# EAGLE design xv11_lidar_controller (EAGLE 6.2)
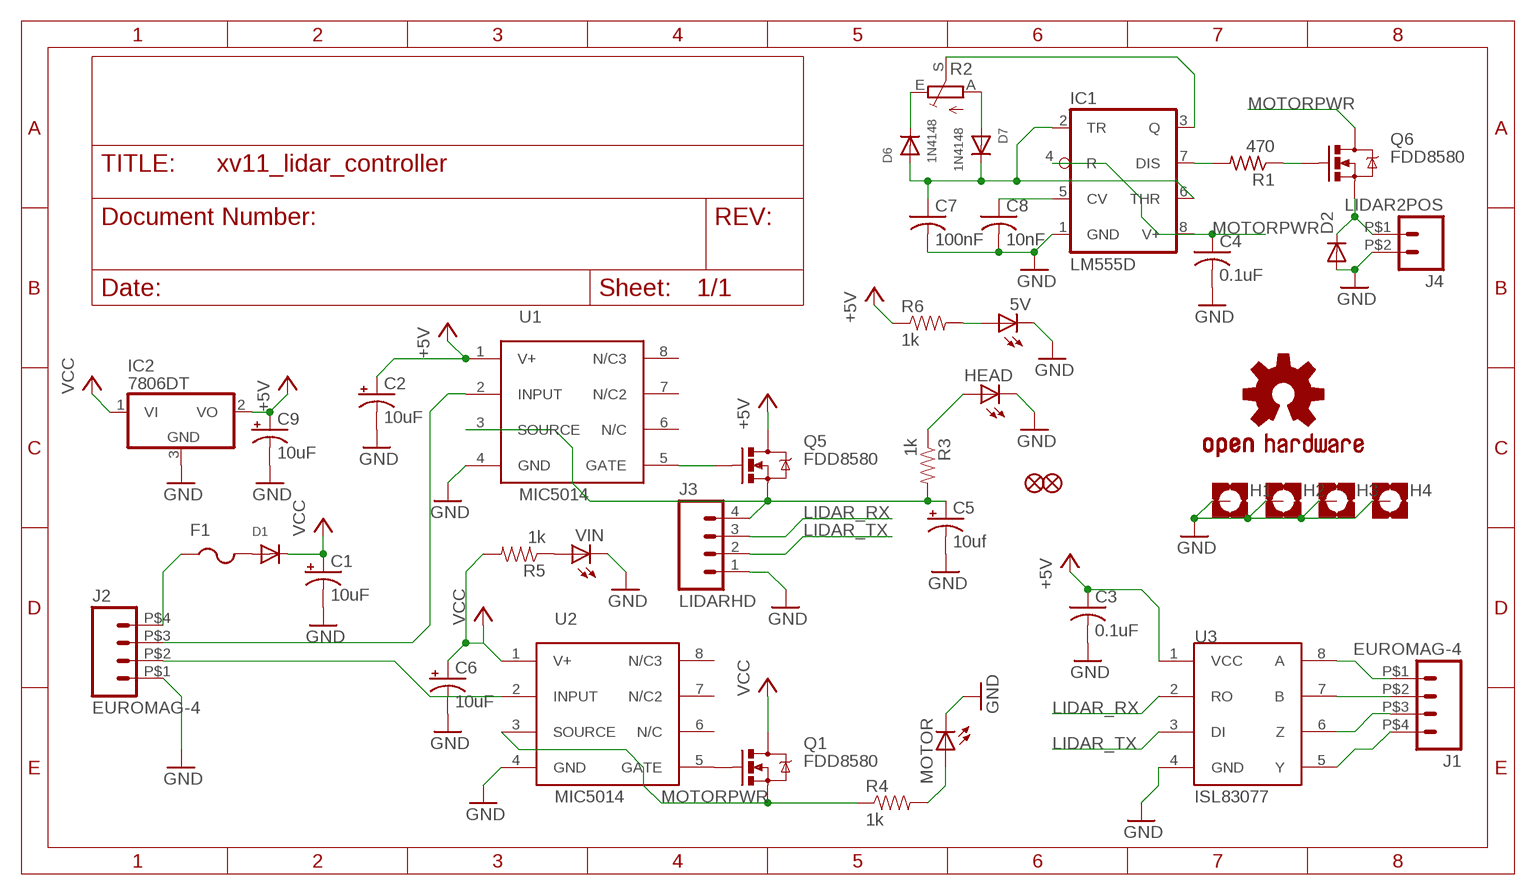
[diagram p0: schematic, sheet 1]

## Parts
5V  LEDCHIP-LED0805  [CHIP-LED0805]
C1  10uF  CPOL-USCT6032  [CT6032]
C2  10uF  CPOL-USCT6032  [CT6032]
C3  0.1uF  C-USC0805  [C0805]
C4  0.1uF  C-USC0805  [C0805]
C5  10uf  CPOL-USCT6032  [CT6032]
C6  10uF  CPOL-USCT6032  [CT6032]
C7  100nF  C-USC0805  [C0805]
C8  10nF  C-USC0805  [C0805]
C9  10uF  CPOL-USCT6032  [CT6032]
D1  DIODESMA  [SMADIODE]
D2  DIODESMA  [SMA-DIODE]
D6  1N4148  DIODESOD-323F  [SOD-323F]
D7  1N4148  DIODESOD-323F  [SOD-323F]
F1  PTCFUSE-1812  [1812]
H1  MOUNT-PAD-SQUARE5.5  [5,5-PAD-SQUARE]
H2  MOUNT-PAD-SQUARE5.5  [5,5-PAD-SQUARE]
H3  MOUNT-PAD-SQUARE5.5  [5,5-PAD-SQUARE]
H4  MOUNT-PAD-SQUARE5.5  [5,5-PAD-SQUARE]
HEAD  LEDCHIP-LED0805  [CHIP-LED0805]
IC1  LM555D  [SO08]
IC2  7806DT  [TO252]
J1  EUROMAG-4  [M4]
J2  EUROMAG-4  [M4]
J3  LIDARHD  LIDAR4POS  [2MM4POS]
J4  LIDAR2POS  [2MM2POS]
JP1  FIDUCIAL1.5X3  [FIDUCIAL-1.5X3]
JP2  FIDUCIAL1.5X3  [FIDUCIAL-1.5X3]
MOTOR  LEDCHIP-LED0805  [CHIP-LED0805]
Q1  FDD8580  MOSFET-NCHANNELFDD8580  [DPAK]
Q5  FDD8580  MOSFET-NCHANNELFDD8580  [DPAK]
Q6  FDD8580  MOSFET-NCHANNELFDD8580  [DPAK]
R1  470  R-US_R0805  [R0805]
R2  TRIM_EU-B25P  [B25P]
R3  1k  RESISTOR0805-RES  [0805]
R4  1k  RESISTOR0805-RES  [0805]
R5  1k  RESISTOR0805-RES  [0805]
R6  1k  RESISTOR0805-RES  [0805]
U1  MIC5014  [SO08]
U2  MIC5014  [SO08]
U3  ISL83077  [SO08]
U$2  OSHW-LOGOL  [OSHW-LOGO-L]
VIN  LEDCHIP-LED0805  [CHIP-LED0805]

## Nets
+5V: C2.+ C3.1 C9.+ IC2.2(VO) Q5.4(D) R6.1 U1.1(V+) U3.1(VCC)
GND: 5V.C C1.- C2.- C3.2 C4.2 C5.- C6.- C7.2 C8.2 C9.- D2.A H1.B5,5(MOUNT) H2.B5,5(MOUNT) H3.B5,5(MOUNT) H4.B5,5(MOUNT) HEAD.C IC1.1(GND) IC2.3(GND) J2.P$1 J3.1 J4.P$2 MOTOR.C U1.4(GND) U2.4(GND) U3.4(GND) VIN.C
LIDAR_RX: J3.3 U3.2(RO)
LIDAR_TX: J3.2 U3.3(DI)
MOTORPWR: C4.1 IC1.4(R) IC1.8(V+) Q1.3(S) Q6.4(D) R4.1 U2.3(SOURCE)
N$1: C5.+ J3.4 Q5.3(S) R3.2 U1.3(SOURCE)
N$2: J2.P$3 U1.2(INPUT)
N$3: HEAD.A R3.1
N$4: R5.1 VIN.A
N$5: Q5.1(G) U1.5(GATE)
N$6: MOTOR.A R4.2
N$7: 5V.A R6.2
N$8: J2.P$2 U2.2(INPUT)
N$9: J1.P$1 U3.8(A)
N$10: D1.A F1.2
N$11: F1.1 J2.P$4
N$12: C8.1 IC1.5(CV)
N$13: C7.1 D6.A D7.C IC1.2(TR) IC1.6(THR)
N$14: D6.C R2.E
N$15: J1.P$2 U3.7(B)
N$16: J1.P$3 U3.6(Z)
N$17: J1.P$4 U3.5(Y)
N$31: D7.A R2.A
N$32: IC1.3(Q) R2.S
N$33: IC1.7(DIS) R1.2
N$34: Q6.1(G) R1.1
N$35: D2.C J4.P$1 Q6.3(S)
N$40: Q1.1(G) U2.5(GATE)
VCC: C1.+ C6.+ D1.C IC2.1(VI) Q1.4(D) R5.2 U2.1(V+)
Unconnected: U1.6(N/C) U1.7(N/C2) U1.8(N/C3) U2.6(N/C) U2.7(N/C2) U2.8(N/C3)

## Library data of the parts
5V HEAD MOTOR VIN = adafruit:LED: LED OSRAM: - CHIPLED LG R971, LG N971, LY N971, LG Q971, LY Q971, LO R971, LY R971 LH N974, LH R974 LS Q976, LO Q976, LY Q976 LO Q996 - Hyper CHIPLED LW Q18S LB Q993, LB Q99A, LB R99A - SideLED LS A670, LO A670, LY A670, LG A670, LP A670 LB A673, LV A673, LT A673, LW A673 LH A674 LY A675 LS A676, LA A676, LO A676, LY A676, LW A676 LS A679, LY A679, LG A679 - Hyper Micro SIDELED® LS Y876, LA Y876, LO Y876, LY Y876 LT Y87S - SmartLED LW L88C, LW L88S LB L89C, LB L89S, LG L890 LS L89K, LO L89K, LY L89K LS L896, LA L896, LO L896, LY L896 - TOPLED LS T670, LO T670, LY T670, LG T670, LP T670 LSG T670, LSP T670, LSY T670, LOP T670, LYG T670 LG T671, LOG T671, LSG T671 LB T673, LV T673, LT T673, LW T673 LH T674 LS T676, LA T676, LO T676, LY T676, LB T676, LH T676, LSB T676, LW T676 LB T67C, LV T67C, LT T67C, LS T67K, LO T67K, LY T67K, LW E67C LS E67B, LA E67B, LO E67B, LY E67B, LB E67C, LV E67C, LT E67C LW T67C LS T679, LY T679, LG T679 LS T770, LO T770, LY T770, LG T770, LP T770 LB T773, LV T773, LT T773, LW T773 LH T774 LS E675, LA E675, LY E675, LS T675 LS T776, LA T776, LO T776, LY T776, LB T776 LHGB T686 LT T68C, LB T68C - Hyper Mini TOPLED® LB M676 - Mini TOPLED Santana® LG M470 LS M47K, LO M47K, LY M47K Source: http://www.osram.convergy.de/
C1 C2 C5 C6 C9 = adafruit:CPOL-US: POLARIZED CAPACITOR, American symbol
C3 C4 C7 C8 = adafruit:C-US: CAPACITOR, American symbol
D1 D6 D7 = adafruit:DIODE: Diode
D2 = SparkFun:DIODE: Diode
F1 = adafruit:PTCFUSE: PTC fuses, resettable thermistors
H1-H4 = holes:MOUNT-PAD-SQUARE: MOUNTING PAD, square
IC1 = adafruit:*555: TIMER Changed DIP package to have round (not oval) pin pads http://www.ladyada.net/library/pcb/eaglelibrary.html
IC2 = adafruit:78*: Positive VOLTAGE REGULATOR Added bigger pads to the TO-92 package
J1 J2 = NASA_LIB:EUROMAG-4
J3 = NASA_LIB:LIDAR4POS
J4 = NASA_LIB:LIDAR2POS
JP1 JP2 = SparkFun:FIDUCIAL: Fiducial Alignment Points Various fiducial points for machine vision alignment.
Q1 Q5 Q6 = SparkFun:MOSFET-NCHANNEL
R1 = adafruit:R-US_: RESISTOR, American symbol
R2 = pot:TRIM_EU-: POTENTIOMETER
R3-R6 = SparkFun:RESISTOR: Resistor Basic schematic elements and footprints for 0603, 1206, and PTH resistors.
U1 U2 = NASA_LIB:MIC5014
U3 = NASA_LIB:ISL83077
U$2 = SparkFun:OSHW-LOGO: Open Source Hardware Logo This logo indicates the piece of hardware it is found on incorporates a OSHW license and/or adheres to the definition of open source hardware found here: http://freedomdefined.org/OSHW

## Board
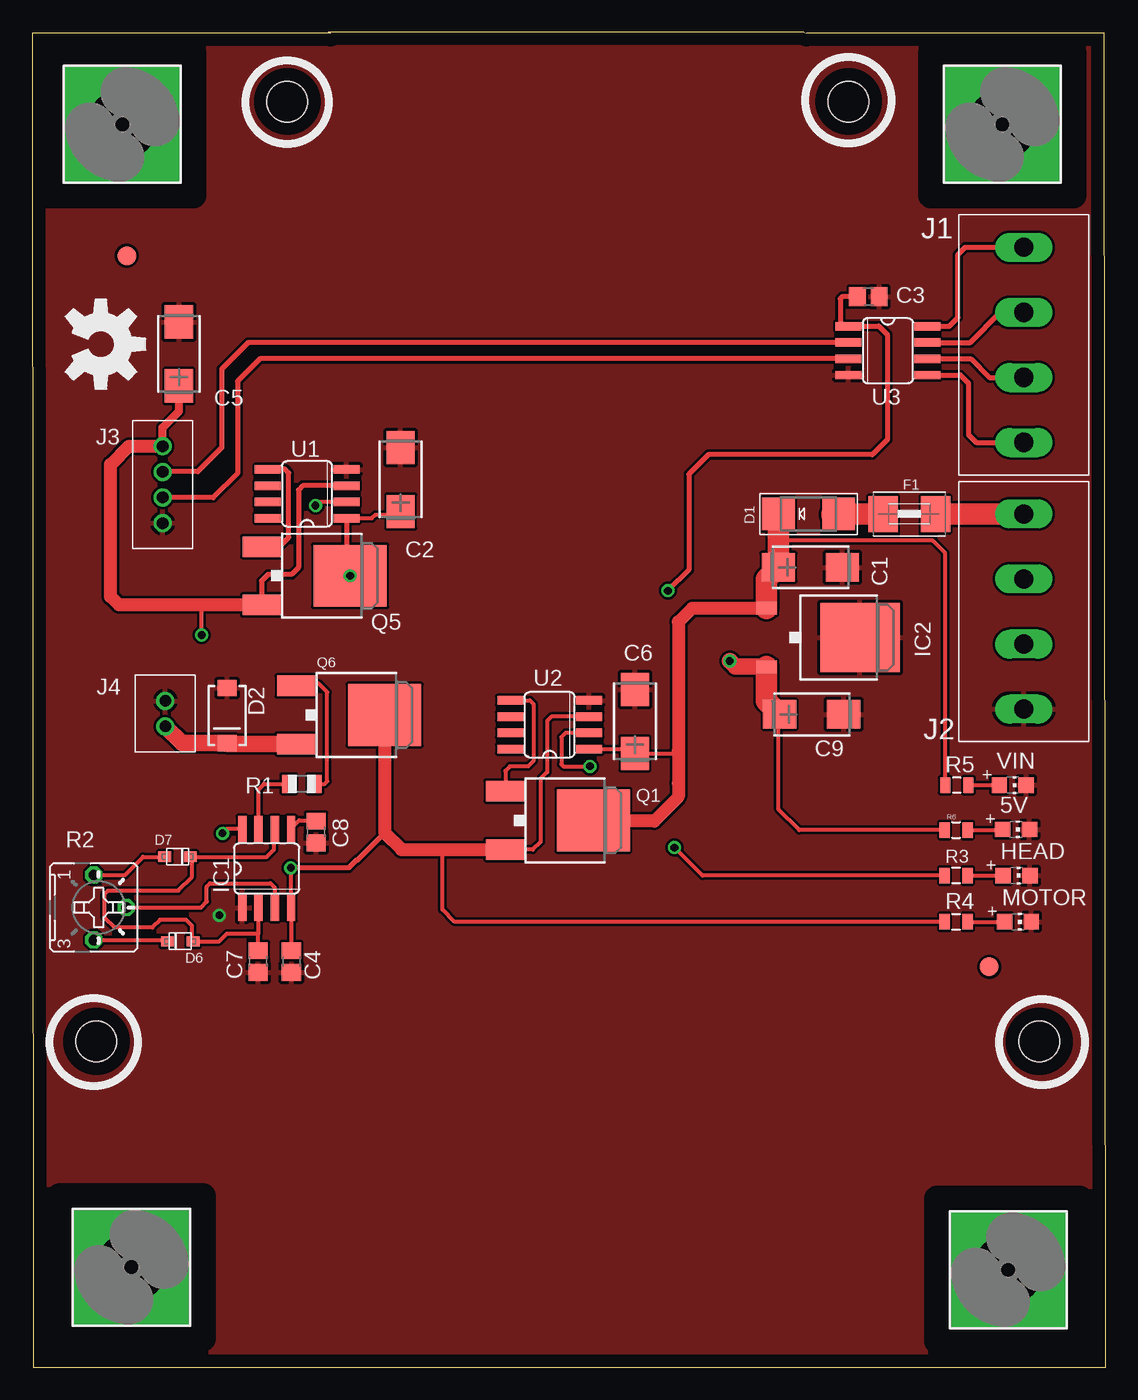
[diagram p1: board, top side]
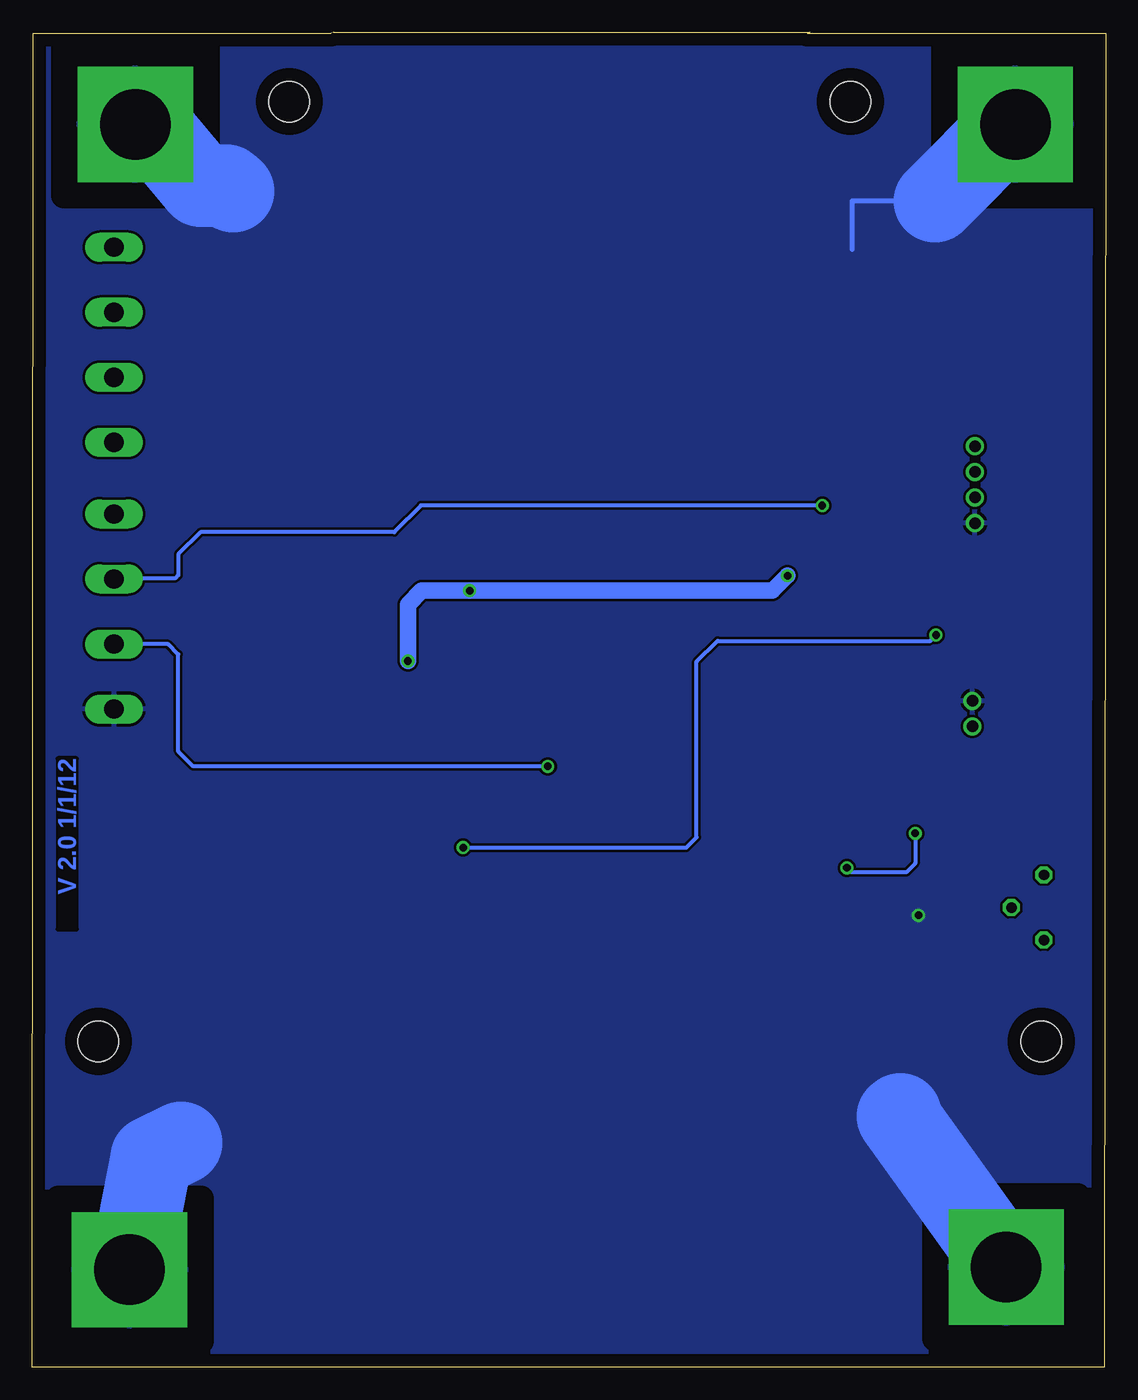
[diagram p2: board, bottom side, seen from below]

Size 83.87 x 104.31 mm. Coordinates in mm from the lower left corner, seen from the top.
Outline: 0.1,0 83.87,0 83.76,104.2 60.5,104.2 60.29,104.31 23.11,104.31 23.31,104.2 0,104.2 0.1,0
Copper layers (1+16): Top 0.035mm / dielectric 1.5mm / Bottom 0.035mm
Design rules: minimum track width 8mil, minimum drill 15mil, track to track 8mil, track to pad 8mil, pad to pad 8mil, via to via 8mil, smd to smd 8mil, copper to edge 40mil, drill to drill 8mil, minimum pad ring 10mil, minimum via ring 8mil, stop-mask expansion 4mil, vias tented up to drill 0mil, thermal gap 10mil
Holes 3.17 mm at 5.02,25.46 78.68,25.46 19.94,98.87 63.77,98.87

### Footprints (pad centres in the part's own frame; a part is rotated, then mirrored left to right if it is on the bottom)
CHIP-LED0805 = smd 1.2 x 1.2: A 0,-1.05; C 0,1.05
CT6032 = smd 2.6 x 2.2: + 2.5,0; - -2.5,0
C0805 = smd 1.3 x 1.5: 1 -0.85,0; 2 0.85,0
SMADIODE = smd 2.54 x 2.54: A 2.349,0; C -2.349,0
SMA-DIODE = smd 1.27 x 1.47: A -2.15,0; C 2.15,0
SOD-323F = smd 1 x 0.8: A -1,0; C 1,0
1812 = smd 2.286 x 2.794: 1 -2.046,0; 2 2.046,0
5,5-PAD-SQUARE = drill 5.5 pad 9 square: B5,5 0,0
SO08 = smd 0.66 x 2.032: 1 -1.905,-3.073; 2 -0.635,-3.073; 3 0.635,-3.073; 4 1.905,-3.073; 5 1.905,3.073; 6 0.635,3.073; 7 -0.635,3.073; 8 -1.905,3.073
TO252 = smd 1 x 1.6: 1 -2.28,-4.8; 2 2.28,-4.8 | smd 5.4 x 6.2: 3 0,2.5
M4 = drill 1.5 long: P$1 0,0; P$2 5.08,0; P$3 10.16,0; P$4 15.24,0
2MM4POS = drill 0.9: 1 3,0; 2 1,0; 3 -1,0; 4 -3,0
2MM2POS = drill 0.9: P$1 -1,0; P$2 1,0
FIDUCIAL-1.5X3 = smd 1.5 x 1.5: 1 0,0
DPAK = smd 1.6 x 3: 1 -2.28,-5.31; 3 2.28,-5.31 | smd 4.826 x 5.715: 4 0,1.588
R0805 = smd 1.1 x 1.4: 1 -1,0; 2 1,0
B25P = drill 0.813 octagon: A -2.54,0; E 2.54,0; S 0,2.54
0805 = smd 0.8 x 1.2: 1 -0.9,0; 2 0.9,0

### Placement (x,y rotation side)
5V  76.86,42.02 270 top
C1  60.8,62.5 180 top
C2  28.8,69.35 270 top
C3  65.32,83.63 0 top
C4  20.26,31.71 270 top
C5  11.48,79.16 270 top
C6  47.09,50.46 270 top
C7  17.67,31.71 270 top
C8  22.19,41.82 270 top
C9  60.9,51.02 180 top
D1  60.65,66.66 0 top
D2  15.23,50.91 270 top
D6  11.58,33.29 180 top
D7  11.37,39.89 0 top
F1  68.52,66.66 180 top
H1  7.06,97.09 0 top
H2  75.79,97.09 0 top
H3  7.77,7.84 0 top
H4  76.25,7.63 0 top
HEAD  76.91,38.42 270 top
IC1  18.33,38.98 0 top
IC2  62.17,57.01 270 top
J1  77.47,87.49 270 top
J2  77.47,51.42 90 top
J3  10.21,68.95 270 top
J4  10.41,51.07 90 top
JP1  7.41,86.83 0 top
JP2  74.77,31.31 0 top
MOTOR  77.01,34.81 270 top
Q1  42.26,42.74 270 top
Q5  23.26,61.84 270 top
Q6  25.95,50.97 270 top
R1  21.08,45.58 180 top
R2  4.82,35.93 270 top
R3  72.18,38.42 180 top
R4  72.18,34.81 0 top
R5  72.23,45.48 180 top
R6  72.18,41.97 0 top
U1  21.48,68.24 90 top
U2  40.43,50.2 90 top
U3  66.85,79.41 270 top
U$2  5.38,79.92 270 top
VIN  76.6,45.48 270 top

### Tracks (layer width: path | path; a pad name or v marks a point on that pad's centre or on a via)
+5V  (via drill 0.6)
  Top 0.305: U1.1 26.54,66.33 26.82,66.61 28.56,66.61 C2.+ | R6.1 59.94,41.97 58.31,43.6 58.31,50.61 58.42,50.71 58.42,51.07 58.62,51.27 58.31,51.27 58.23,51.19
  Top 0.406: U1.1 24.56,62.57 24.28,62.29 24.63,62.29 24.84,62.09 24.84,61.85 Q5.4 | C3.1 63.29,83.63 63.14,83.48 63.14,81.39 63.19,81.34 63.75,81.34 | 63.75,81.34 U3.1 | 63.75,81.34 66.14,81.34 66.8,80.68 66.8,72.45 65.63,71.29 52.83,71.29 51.3,69.76 51.3,62.29 v49.68,60.67
  Top 1.27: IC2.2 54.95,54.73 v54.5,55.18 | Q5.4 24.85,61.85 25.19,62.19
  Top 1.676: IC2.2 57.37,52.05 58.23,51.19 C9.+
  Bottom 1.27: v54.5,55.18 54.5,59.6 53.44,60.67 v49.68,60.67 49.17,60.67 26.02,60.67 Q5.4
  other vias: 24.85,61.84
GND  (via drill 0.6)
  Bottom 0.406: 13.36,91.1 19.81,91.1 19.81,87.34
  Bottom 6.452: H3.B5,5 16.25,19.62 16.05,19.77 | H1.B5,5 7.36,97.09 13.36,91.1 | H4.B5,5 74.52,16.42 72.23,17.54 | H2.B5,5 74.72,97.09 70.71,92.32 68.68,92.32 68.17,91.86
  other vias: 14.63,35.32
  pour Bottom: -0.01,104.15 83.76,104.15 83.87,0.27 0.1,0.27
  pour Top: -0.01,104.2 83.76,104.2 83.97,-0.14 0.2,-0.14
LIDAR_RX
  Top 0.406: U3.2 16.89,80.05 14.83,77.99 14.83,71.84 12.95,69.96 10.22,69.96 J3.3
LIDAR_TX
  Top 0.406: U3.3 17.8,78.78 16.05,77.03 16.05,69.81 14.17,67.93 10.22,67.93 J3.2
MOTORPWR  (via drill 0.6)
  Top 0.305: C4.1 20.26,35.88 IC1.4 20.21,35.93 v20.21,39.03 | IC1.8 15.21,42.05 v14.88,41.72 | 27.88,49.39 27.07,50.2 27.39,50.2 27.54,50.05 | U2.3 40.56,50.84 40.23,50.51 40.23,46.49 39.72,45.99 39.72,41.06 39.11,40.45 Q1.3 | 32.15,40.45 32.15,40.14 32.05,40.04 32.05,35.78 33.02,34.81 R4.1
  Top 0.406: Q6.4 25.85,50.97 25.34,50.46 | v20.21,39.03 24.73,39.03 25.34,39.64 25.42,39.64 27.54,41.76
  Top 1.016: Q6.4 27.54,50.05 27.54,41.76 28.85,40.45 32.15,40.45 35.37,40.45 Q1.3
  Bottom 0.305: v14.88,41.72 14.88,39.38 15.59,38.67 19.86,38.67 v20.21,39.03
N$1  (via drill 0.6)
  Top 0.305: 14.93,59.51 14.88,59.56 | v13.25,57.21 13.25,59.56 | R3.2 52.37,38.42 v50.19,40.6
  Top 0.406: U1.3 21.15,68.87 20.82,68.54 20.82,62.5 20.26,61.94 18.44,61.94 17.93,61.43 17.93,59.25 17.88,59.19 17.88,59.48 Q5.3
  Top 0.61: J3.4 10.21,73.42 11.48,74.69 C5.+
  Top 1.016: Q5.3 14.88,59.56 13.25,59.56 6.8,59.56 6.14,60.21 6.14,70.52 7.56,71.95 J3.4
  Bottom 0.305: v50.19,40.6 32.76,40.6 31.95,41.41 31.95,55.13 30.32,56.76 13.71,56.76 v13.25,57.21
N$2  (via drill 0.6)
  Top 0.305: U1.2 22.42,67.6 v22.14,67.32
  Bottom 0.305: v22.14,67.32 53.49,67.32 55.57,65.24 70.71,65.24 72.44,63.51 72.44,61.89 72.69,61.63 77.41,61.63 J2.P$3
N$3
  Top 0.305: R3.1 HEAD.A
N$4
  Top 0.305: R5.1 VIN.A
N$5
  Top 0.406: Q5.1 19.34,64.12 20.06,64.83 20.06,69.86 19.76,70.17 18.44,70.17 U1.5
N$6
  Top 0.305: R4.2 MOTOR.A
N$7
  Top 0.305: R6.2 75.75,41.97 5V.A
N$8  (via drill 0.6)
  Top 0.305: U2.2 41.68,49.57 41.35,49.24 41.35,47.1 41.5,46.95 v43.58,46.95
  Bottom 0.305: v43.58,46.95 71.27,46.95 72.44,48.12 72.44,55.69 73.25,56.5 77.16,56.5 77.21,56.55 77.41,56.55 J2.P$2
N$9
  Top 0.406: U3.8 71.65,81.32 72.33,82 72.33,86.93 72.89,87.49 J1.P$1
N$10
  Top 1.676: F1.2 D1.A | D1.A 62.48,66.66 62.48,66.56 63,66.56 D1.A
N$11
  Top 1.676: J2.P$4 F1.1
N$12
  Top 0.305: IC1.5 20.24,42.1 20.87,42.74 22.13,42.74 C8.1
N$13
  Top 0.305: C7.1 17.67,33.9 | 17.67,33.9 17.67,33.95 | 17.67,35.17 17.67,35.88 IC1.2 17.7,35.19 17.67,35.17 | 17.62,33.9 15.24,33.9 14.63,33.29 D6.A 12.49,33.29 12.49,34.51 12.03,34.96 10,34.96 9.39,34.35 6.45,34.35 5.68,35.12 5.68,37 5.94,37.25 11.43,37.25 12.49,38.32 12.49,39.77 D7.C 18.33,39.89 18.89,40.45 18.89,41.97 IC1.6 | 17.62,33.9 17.67,33.95 | 17.67,35.17 17.67,33.95 | 17.67,33.9 17.62,33.9
N$14
  Top 0.305: R2.E 10.48,33.39 D6.C
N$15
  Top 0.406: U3.7 73.27,80.05 75.64,82.41 J1.P$2
N$16
  Top 0.406: U3.6 73.32,78.78 74.77,77.33 J1.P$3
N$17
  Top 0.406: U3.5 72.51,77.51 73.15,76.87 73.15,72.86 73.76,72.25 J1.P$4
N$31
  Top 0.305: R2.A 7.26,38.47 8.68,39.89 D7.A
N$32
  Top 0.305: R2.S 13.2,35.93 13.66,36.39 13.66,37.55 13.91,37.81 18.64,37.81 18.94,37.5 18.94,36.23 18.99,36.18 18.99,35.93 IC1.3
N$33
  Top 0.305: IC1.7 17.7,45.15 18.13,45.58 R1.2
N$34
  Top 0.305: R1.1 22.86,45.58 23.06,45.78 23.06,52.74 22.4,53.4 20.8,53.4 Q6.1
N$35
  Top 1.27: Q6.3 15.31,48.69 D2.C 11.71,48.76 J4.P$1
N$40
  Top 0.305: U2.5 38.88,52.11 39.16,51.83 39.16,47.36 38.76,46.95 37.33,46.95 36.98,46.6 36.98,45.04 Q1.1
VCC
  Top 0.305: U2.1 46.71,48.3 46.83,48.17 46.87,48.17 C6.+ 50.28,47.96 50.49,48.17 | 50.64,45.48 50.49,45.63 | R5.2 71.33,63.6 70.35,64.58 58.35,64.58 58.3,64.63
  Top 1.016: IC2.1 51.55,59.29 50.49,58.23 50.49,48.17 50.49,45.63 50.49,44.56 48.61,42.68 43.78,42.68 | 43.78,42.68 43.63,42.53 | Q1.4 43.84,42.74 43.78,42.68
  Top 1.676: D1.C 58.3,64.63 C1.+ 57.37,61.57 IC2.1

### Text on the board
Bottom: V 2.0 1/1/12